# EAGLE design powersupply (EAGLE 9.5.2)
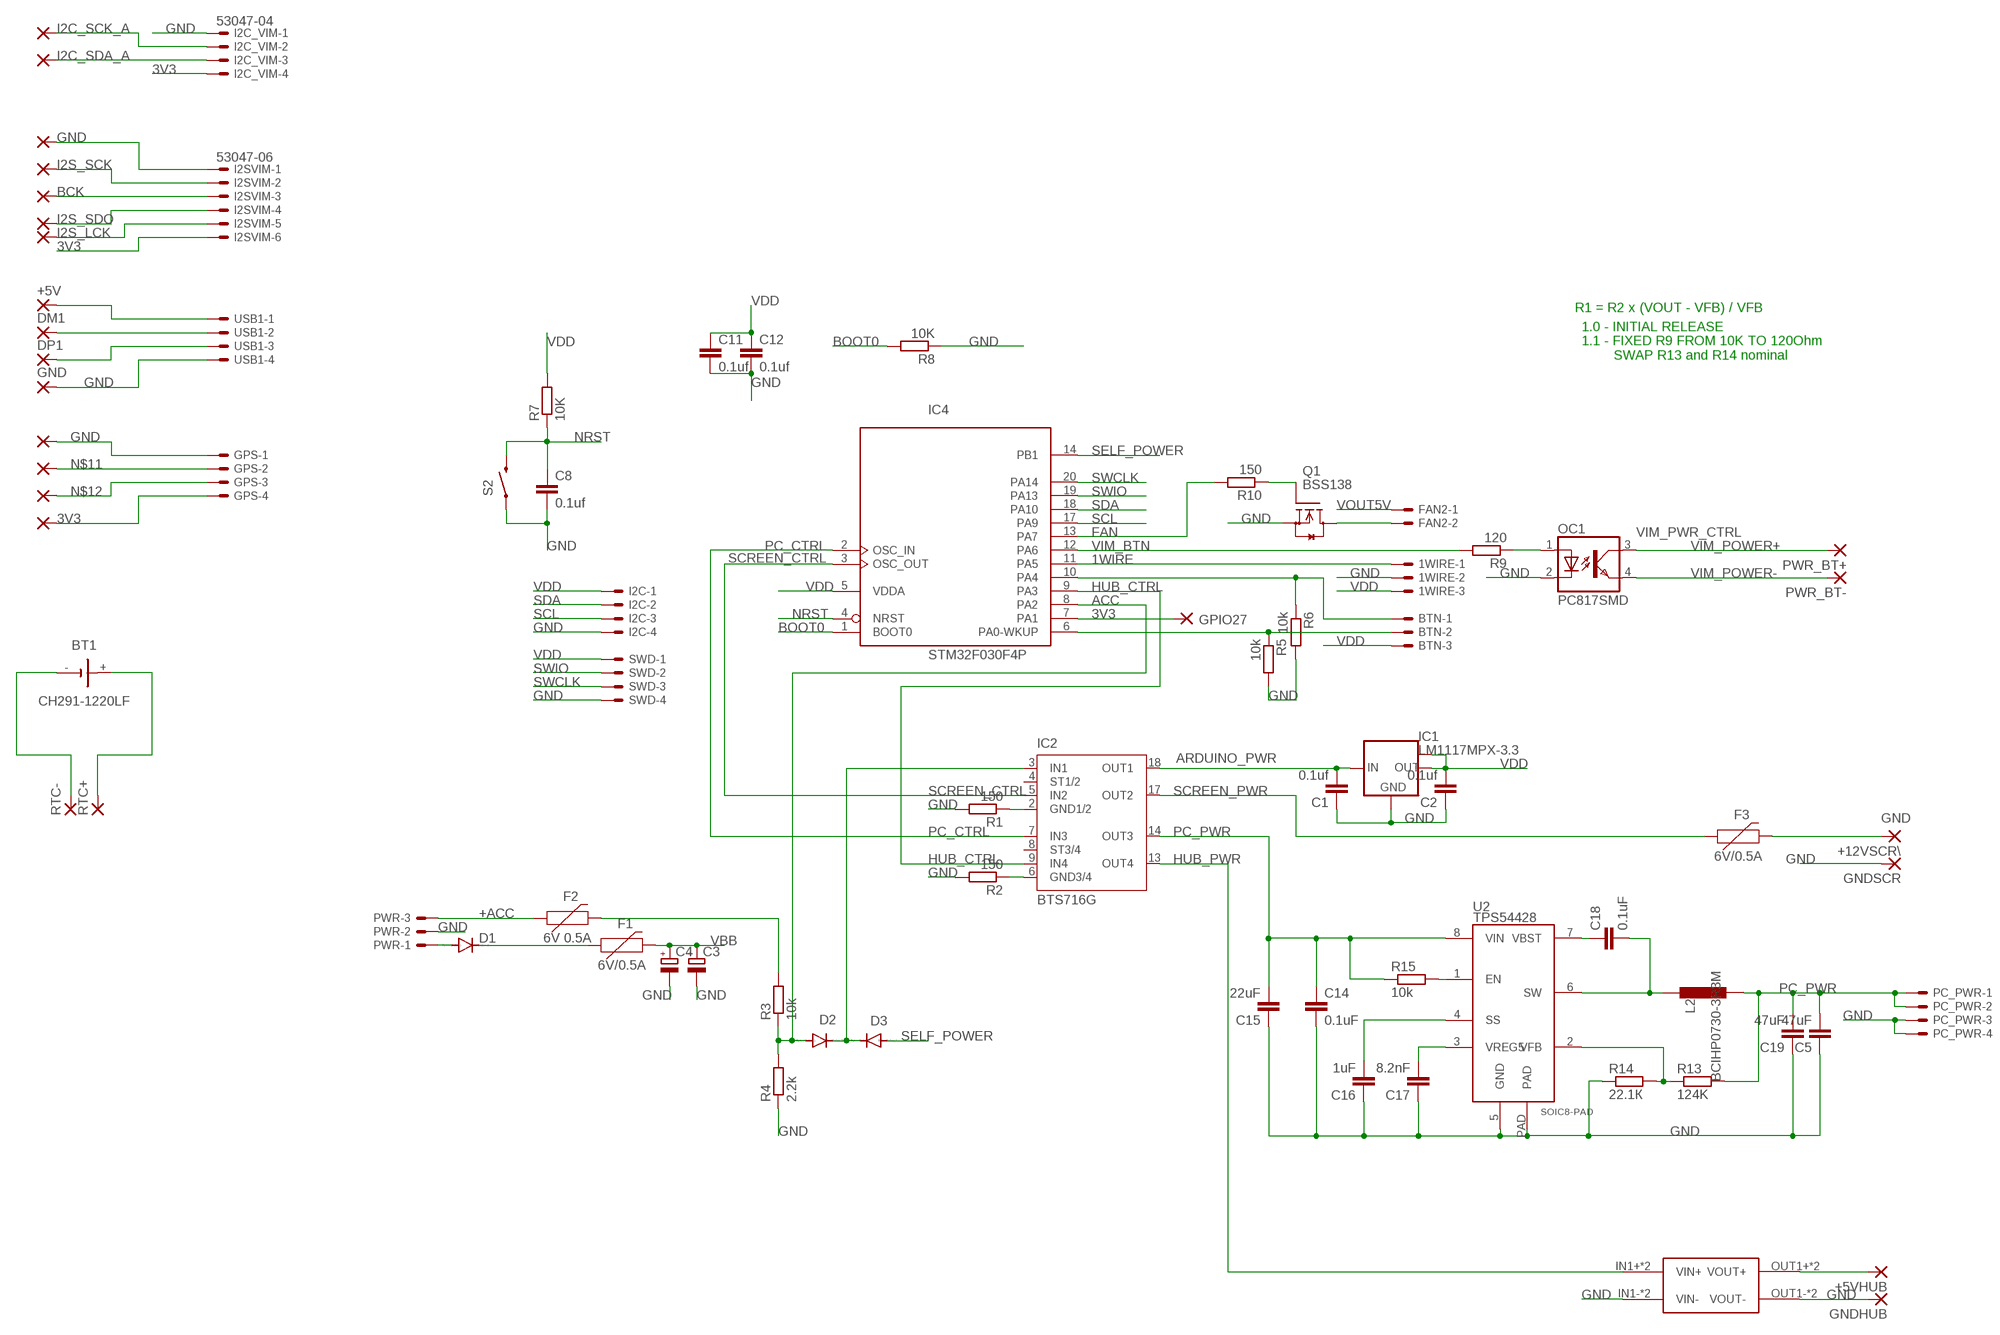
[diagram p0: schematic, sheet 1]

## Parts
1WIRE  53047-03  [53047-03]
3V3_1  1,6/0,8  [1,6/0,8]
22  1,6/0,8  [1,6/0,8]
23  1,6/0,8  [1,6/0,8]
28  1,6/0,8  [1,6/0,8]
29  1,6/0,8  [1,6/0,8]
30  1,6/0,8  [1,6/0,8]
31  1,6/0,8  [1,6/0,8]
32  1,6/0,8  [1,6/0,8]
+5V  1,6/0,8  [1,6/0,8]
+5VHUB  1,6/0,8  [1,6/0,8]
+12VSCR\  1,6/0,8  [1,6/0,8]
BT1  CH291-1220LF  [CH291-1220LF]
BTN  53047-03  [53047-03]
C1  0.1uf  C-EUC0805  [C0805]
C2  0.1uf  C-EUC0805  [C0805]
C3  CPOL-EUUD-8X10  [UD-8X10_NICHICON]
C4  CPOL-EUUD-8X10  [UD-8X10_NICHICON]
C5  47uF  C-EUC1206  [C1206]
C8  0.1uf  C-EUC0805  [C0805]
C11  0.1uf  C-EUC0805  [C0805]
C12  0.1uf  C-EUC0805  [C0805]
C14  0.1uF  C-EUC0805K  [C0805K]
C15  22uF  C-EUC0805  [C0805]
C16  1uF  C-EUC0805K  [C0805K]
C17  8.2nF  C-EUC0805K  [C0805K]
C18  0.1uF  C-EUC0805K  [C0805K]
C19  47uF  C-EUC1206  [C1206]
D1  DIODE-SMB  [SMB]
D2  DIODE-SOD323-W  [SOD323-W]
D3  DIODE-SOD323-W  [SOD323-W]
DM1  1,6/0,8  [1,6/0,8]
DP1  1,6/0,8  [1,6/0,8]
F1  6V/0.5A  PPTC_HALF-AMP  [1206]
F2  6V 0.5A  PPTC_6V500MA  [0805]
F3  6V/0.5A  PPTC_HALF-AMP  [1206]
FAN2  53047-02  [53047-02]
GND  1,6/0,8  [1,6/0,8]
GNDGPS  1,6/0,8  [1,6/0,8]
GNDHUB  1,6/0,8  [1,6/0,8]
GNDSCR  1,6/0,8  [1,6/0,8]
GPIO27  1,6/0,8  [1,6/0,8]
GPS  53047-04  [53047-04]
I2C  i2c  53047-04  [53047-04]
I2C_VIM  53047-04  [53047-04]
I2SVIM  53047-06  [53047-06]
IC1  LM1117MPX-3.3  [SOT223]
IC2  BTS716G  [PG-DSO-20]
IC4  STM32F030F4P  [TSSOP20-I]
L2  BCIHP0730-3R3M  VLS5045EX  [VLS4045EX]
OC1  PC817SMD  [DIL04SMD]
PC_PWR  i2c  53047-04  [53047-04]
PWR  JST-XH-03-PIN-ROUND-PAD  [JST-XH-03-PACKAGE-ROUND-PAD]
PWR_BT+  1,6/0,8  [1,6/0,8]
PWR_BT-  1,6/0,8  [1,6/0,8]
Q1  BSS138  [SOT23]
R1  150  R-EU_R0805  [R0805]
R2  150  R-EU_R0805  [R0805]
R3  10k  R-EU_R0805  [R0805]
R4  2.2k  R-EU_R0805  [R0805]
R5  10k  R-EU_R0805  [R0805]
R6  10k  R-EU_R0805  [R0805]
R7  10K  R-EU_M0805  [M0805]
R8  10K  R-EU_M0805  [M0805]
R9  120  R-EU_M0805  [M0805]
R10  150  R-EU_R0805  [R0805]
R13  124K  R-EU_M0805  [M0805]
R14  22.1К  R-EU_M0805  [M0805]
R15  10k  R-EU_M0805  [M0805]
RTC+  1,6/0,8  [1,6/0,8]
RTC-  1,6/0,8  [1,6/0,8]
RX  1,6/0,8  [1,6/0,8]
S2  SWITCH-MOMENTARY-2-SMD-1101NE  [TACTILE-SWITCH-1101NE]
SWD  53047-04  [53047-04]
TX  1,6/0,8  [1,6/0,8]
U2  TPS54428  [PDSO-8]
U$1  MP1584  [DC-BRICK]
USB1  53047-04  [53047-04]

## Nets
1WIRE: 1WIRE.1 IC4.11(PA5)
3V3: 3V3_1.1(P) GPIO27.1(P) GPS.4 I2C_VIM.4 I2SVIM.6 IC4.7(PA1)
+ACC: F2.2 R3.2
ACC: D2.A IC4.8(PA2) R3.1 R4.2
ARDUINO_PWR: C1.2 IC1.3(IN) IC2.18(OUT1)
BCK: 30.1(P) I2SVIM.3
BOOT0: IC4.1(BOOT0) R8.2
FAN: IC4.13(PA7) R10.2
GND: 1WIRE.2 28.1(P) C1.1 C2.1 C3.- C4.- C5.1 C8.2 C11.2 C12.2 C14.2 C15.1 C16.1 C17.1 C19.1 GND.1(P) GNDGPS.1(P) GNDHUB.1(P) GNDSCR.1(P) GPS.1 I2C.4 I2C_VIM.1 I2SVIM.1 IC1.1(GND) OC1.2(C) PC_PWR.3 PC_PWR.4 PWR.2 Q1.2(S) R1.2 R2.2 R4.1 R5.2 R6.2 R8.1 R14.1 S2.P$1 SWD.4 U2.5(GND) U2.PAD U$1.IN1-(VIN-) U$1.IN2-(VIN-) U$1.OUT1-(VOUT-) U$1.OUT2-(VOUT-) USB1.4
HUB_CTRL: IC2.9(IN4) IC4.9(PA3)
HUB_PWR: IC2.13(OUT4) U$1.IN1+(VIN+) U$1.IN2+(VIN+)
I2C_SCK_A: 22.1(P) I2C_VIM.2
I2C_SDA_A: 23.1(P) I2C_VIM.3
I2S_LCK: 32.1(P) I2SVIM.5
I2S_SCK: 29.1(P) I2SVIM.2
I2S_SDO: 31.1(P) I2SVIM.4
N$1: IC2.2(GND1/2) R1.1
N$2: +5V.1(P) USB1.1
N$3: FAN2.2 Q1.3(D)
N$4: D2.C D3.C IC2.3(IN1)
N$5: IC2.6(GND3/4) R2.1
N$6: BTN.1 IC4.10(PA4) R6.1
N$7: DM1.1(P) USB1.2
N$8: DP1.1(P) USB1.3
N$9: Q1.1(G) R10.1
N$10: BT1.- RTC-.1(P)
N$11: GPS.2 RX.1(P)
N$12: GPS.3 TX.1(P)
N$13: BTN.2 IC4.6(PA0-WKUP) R5.1
N$14: F2.1 PWR.3
N$15: BT1.+ RTC+.1(P)
N$16: D1.A PWR.1
N$18: +5VHUB.1(P) U$1.OUT1+(VOUT+) U$1.OUT2+(VOUT+)
N$19: D1.C F1.1
N$23: +12VSCR\.1(P) F3.2
N$51: C16.2 U2.4(SS)
N$52: C17.2 U2.3(VREG5)
N$53: C18.1 U2.7(VBST)
N$54: C18.2 L2.1 U2.6(SW)
N$55: R13.1 R14.2 U2.2(VFB)
N$56: R15.2 U2.1(EN)
NRST: C8.1 IC4.4(NRST) R7.1 S2.P$2
PC_CTRL: IC2.7(IN3) IC4.2(OSC_IN)
PC_PWR: C14.1 C15.2 IC2.14(OUT3) R15.1 U2.8(VIN)
SCL: I2C.3 IC4.17(PA9)
SCREEN_CTRL: IC2.5(IN2) IC4.3(OSC_OUT)
SCREEN_PWR: F3.1 IC2.17(OUT2)
SDA: I2C.2 IC4.18(PA10)
SELF_POWER: D3.A IC4.14(PB1)
SWCLK: IC4.20(PA14) SWD.3
SWIO: IC4.19(PA13) SWD.2
VBB: C3.+ C4.+ F1.2
VDD: 1WIRE.3 BTN.3 C2.2 C11.1 C12.1 I2C.1 IC1.2(OUT) IC1.TAB(OUT1) IC4.5(VDDA) R7.2 SWD.1
VIM_BTN: IC4.12(PA6) R9.2
VIM_POWER+: OC1.3(COL) PWR_BT+.1(P)
VIM_POWER-: OC1.4(EMIT) PWR_BT-.1(P)
VIM_PWR_CTRL: OC1.1(A) R9.1
VOUT5V: C5.2 C19.2 FAN2.1 L2.2 PC_PWR.1 PC_PWR.2 R13.2
Unconnected: IC2.4(ST1/2) IC2.8(ST3/4)

## Notes on the sheet
- R1 = R2 x (VOUT - VFB) / VFB
- 1.0 - INITIAL RELEASE
  1.1 - FIXED R9 FROM 10K TO 120Ohm
          SWAP R13 and R14 nominal

## Power pins joined to a net without a drawn wire
GND: IC4.15(GND)
VBB: IC2.1(VBB) IC2.10(VBB) IC2.11(VBB) IC2.12(VBB) IC2.15(VBB) IC2.16(VBB) IC2.19(VBB) IC2.20(VBB)
VDD: IC4.16(VDD)

## Library data of the parts
1WIRE BTN = con-molex:53?-03: CONNECTOR wire to board 1.25 mm (.049 inch) pitch header; MF: MOLEX; MPN: 530470310; OC_FARNELL: 9732853; OC_NEWARK: 14R5412
3V3_1 22 23 28-32 +5V +5VHUB +12VSCR\ DM1 DP1 GND GNDGPS GNDHUB GNDSCR GPIO27 PWR_BT+ PWR_BT- RTC+ RTC- RX TX = wirepad:1,6/0,8: THROUGH-HOLE PAD
BT1 = battery:CH291-1220LF: Battery Holder, SMT, 12mm multicomp PART NO. CH291-1220LF Source: Data sheet <http://www.farnell.com/datasheets/1505860.pdf>
C1 C2 C8 C11 C12 C14 C18 = rcl:C-EU: CAPACITOR, European symbol; MPN: CL21B104KBFNNNE; SPICEPREFIX: C
C3 C4 = rcl:CPOL-EU: POLARIZED CAPACITOR, European symbol; SPICEPREFIX: C
C5 C19 = rcl:C-EU: CAPACITOR, European symbol; MPN: CL31A476MPHNNNE; SPICEPREFIX: C
C15 = rcl:C-EU: CAPACITOR, European symbol; MPN: CL31A226KAHNNNE; SPICEPREFIX: C; URL: https://lcsc.com/product-detail/Multilayer-Ceramic-Capacitors-MLCC-SMD-SMT_SAMSUNG_CL31A226KAHNNNE_22uF-226-10-25V_C12891.html
C16 = rcl:C-EU: CAPACITOR, European symbol; MPN: CL21B105KAFNNNE; SPICEPREFIX: C; URL: https://lcsc.com/product-detail/Multilayer-Ceramic-Capacitors-MLCC-SMD-SMT_Samsung-Electro-Mechanics_CL21B105KAFNNNE_Samsung-Electro-Mechanics-CL21B105KAFNNNE_C116352.html
C17 = rcl:C-EU: CAPACITOR, European symbol; MPN: CL21B822KBANNNC; SPICEPREFIX: C; URL: https://lcsc.com/product-detail/Multilayer-Ceramic-Capacitors-MLCC-SMD-SMT_SAMSUNG_CL21B822KBANNNC_8-2nF-822-10-50V_C170117.html
D1-D3 = diode:DIODE-: DIODE
F1 F3 = SparkFun-Fuses:PPTC: Resettable Fuse PPTC Resettable Fuse. Really a sort of resistor with a polymeric positive temperature coefficient whose resistance increases dramatically with an increase in temperature. When heated by the power passing through the resistance rises causing the current to be limited, protecting the circuit. This is achieved by the transition of the polymer from a crystalline to an amorphous state where the conductive carbon separates breaking the conductive pathways found in the cool crystalline structure. When a PPTC cools back down it resumes conducting letting the circuit turn back on. SparkFun Products: SparkFun RedBoard - Programmed with Arduino <https://www.sparkfun.com/products/12757> Pro Micro - 5V/16MHz <https://www.sparkfun.com/products/12640> Arduino Pro 328 - 5V/16MHz <https://www.sparkfun.com/products/10915> MP3 Trigger <https://www.sparkfun.com/products/13720>; PROD_ID: RES-08585
F2 = SparkFun-Fuses:PPTC: Resettable Fuse PPTC Resettable Fuse. Really a sort of resistor with a polymeric positive temperature coefficient whose resistance increases dramatically with an increase in temperature. When heated by the power passing through the resistance rises causing the current to be limited, protecting the circuit. This is achieved by the transition of the polymer from a crystalline to an amorphous state where the conductive carbon separates breaking the conductive pathways found in the cool crystalline structure. When a PPTC cools back down it resumes conducting letting the circuit turn back on. SparkFun Products: SparkFun RedBoard - Programmed with Arduino <https://www.sparkfun.com/products/12757> Pro Micro - 5V/16MHz <https://www.sparkfun.com/products/12640> Arduino Pro 328 - 5V/16MHz <https://www.sparkfun.com/products/10915> MP3 Trigger <https://www.sparkfun.com/products/13720>; PROD_ID: 13945
FAN2 = con-molex:53?-02: CONNECTOR wire to board 1.25 mm (.049 inch) pitch header; MF: MOLEX; MPN: 53047-0210; OC_FARNELL: 9733051; OC_NEWARK: 57H4701
GPS I2C I2C_VIM PC_PWR SWD USB1 = con-molex:53?-04: CONNECTOR wire to board 1.25 mm (.049 inch) pitch header; MF: WALDOM/MOLEX; MPN: 53047-0410; OC_FARNELL: 9733060; OC_NEWARK: 38C9900
I2SVIM = con-molex:53?-06: CONNECTOR wire to board 1.25 mm (.049 inch) pitch header
IC1 = lm1117:LM1117MPX-*; MPN: LM1117IMPX-3.3/NOPB
IC2 = infineon:BTS716G: Smart High-Side Power Switch Four Channels: 4 x 140mOhm staus Feedback Source: http://www.infineon.com/dgdl/BTS716G.pdf; OC_FARNELL: unknown; OC_NEWARK: unknown
IC4 = micro-stm_v3:STM32F030F*P: ARM 32-bit Cortex™-M0 CPU 48 MHz maximum frequency 16 Kbytes of Flash memory 4 kbytes of SRAM 15 GPIOs 2.4 to 3.6 V application supply
L2 = bt_inductor:VLS5045EX: TDK VLS-EX Series, VLS5045EX Type Shielded Wirewound Inductor for power circuits. High magnetic shield construction achieved by a ferrite magnetic material and compatible with high-density mounting. Larger current and lower Rdc have been achieved by optimizing the ferrite core figure. Datasheet.pdf <https://product.tdk.com/info/en/catalog/datasheets/inductor_commercial_power_vls5045ex_en.pdf>; MN: TDK; MPN: VLS5045EX-3R3N; URL: https://lcsc.com/product-detail/Power-Inductors_TDK_VLS5045EX-3R3N_TDK-VLS5045EX-3R3N_C307875.html
OC1 = my_mixed:PC817*: SHARP OPTO COUPLER; MPN: PC817X2CSP9F
PWR = Rembrandt Electronics - JST XH Connectors v1-0:JST-XH-03-PIN: JST XH Connector 2 Pin Wire to board connector. Pitch: 2,54 mm, (0.100") Number of pins: 3 Created by Rembrandt Electronics www.rembrandtelectronics.com
Q1 = m-pad-2.1:BSS138: Fairchild Semiconductors BSS138 N-Channel Logic Level Enhancement Mode Field Effect Transistor General Description: These N-Channel enhancement mode field effect transistors are produced using Fairchild's proprietary, high cell density, DMOS technology. These products have been designed to minimize on-state resistance while provide rugged, reliable, and fast switching performance.These products are particularly suited for low voltage, low current applications such as small servo motor control, power MOSFET gate drivers, and other switching applications. Features: 0.22 A, 50 V. RDS(ON) = 3.5Ohm @ VGS = 10 V RDS(ON) = 6.0Ohm @ VGS = 4.5 V High density cell design for extremely low RDS(ON) Rugged and Reliable Compact industry standard SOT-23 surface mount package Please send any comments to: messi@users.sourceforge.net
R1-R6 R10 = resistor:R-EU_: RESISTOR, European symbol
R7-R9 R15 = rcl:R-EU_: RESISTOR, European symbol; SPICEPREFIX: R
R13 = rcl:R-EU_: RESISTOR, European symbol; MPN: TR0805B22K1P0525Z; SPICEPREFIX: R
R14 = rcl:R-EU_: RESISTOR, European symbol; MPN: AR05BTCW1253; SPICEPREFIX: R
S2 = dc-dc:SWITCH-MOMENTARY-2: Various NO switches- pushbuttons, reed, etc
U2 = borkedlabs-powerics:TPS54428; MANU: TI; MPN: TPS54428DDAR; PACKAGE: SOIC8-PAD; URL: https://lcsc.com/product-detail/DC-DC-Converters_Texas-Instruments_TPS54428DDAR_Texas-Instruments-Texas-Instruments-TPS54428DDAR_C138717.html
U$1 = MP1584-dc-brick:MP1584: MP1584-dc-brick-pcb Step down Input: 4.5V - 28V Ouput 0.8V - 25V max. 3A Cheap on ebay

## Board
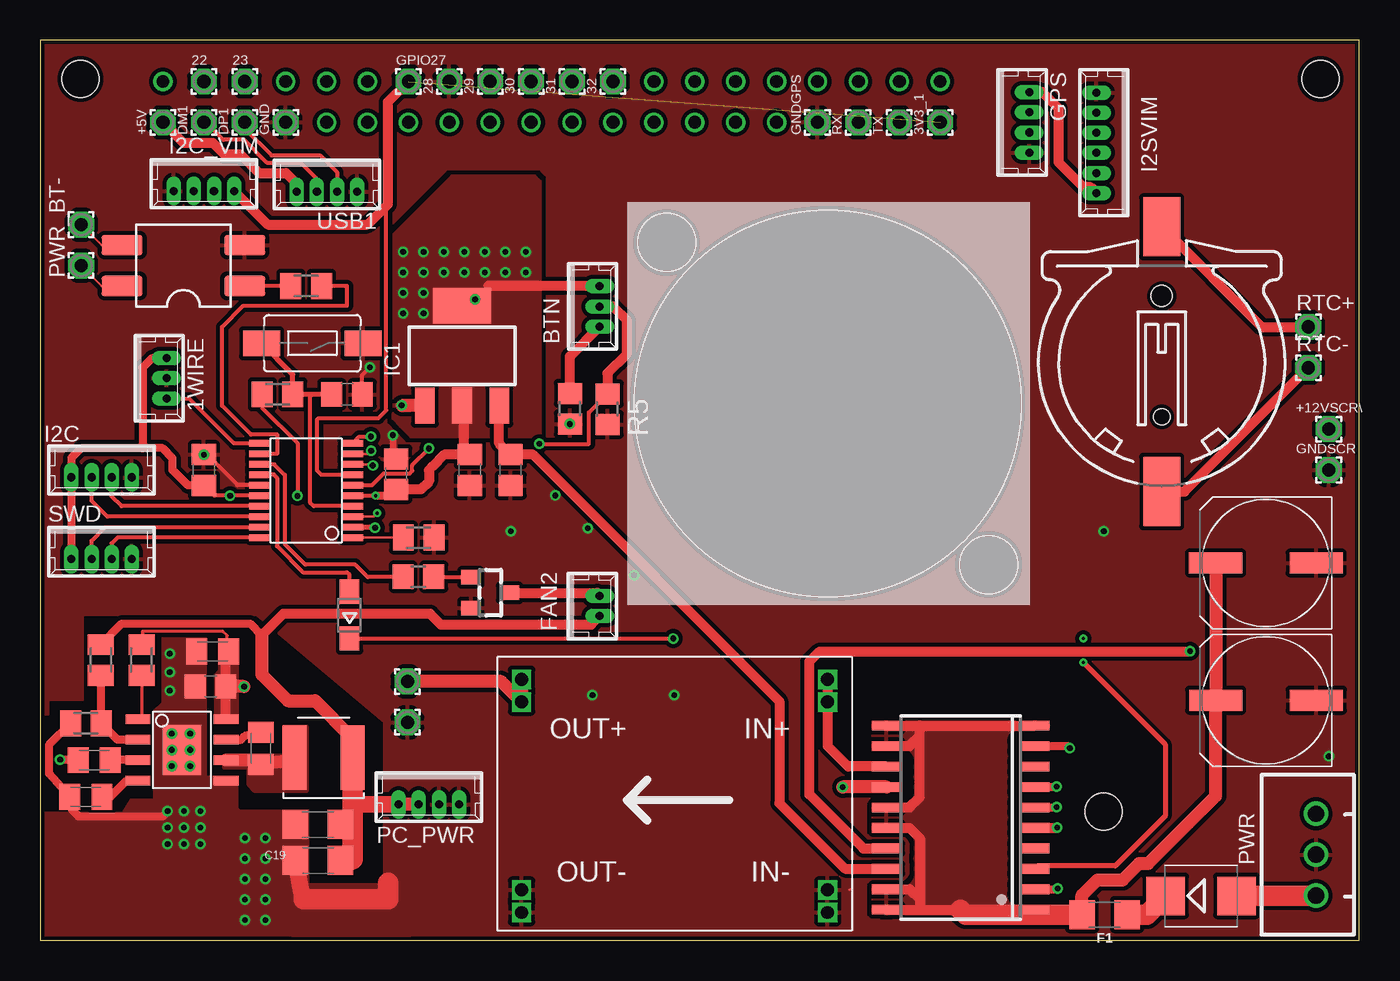
[diagram p1: board, top side]
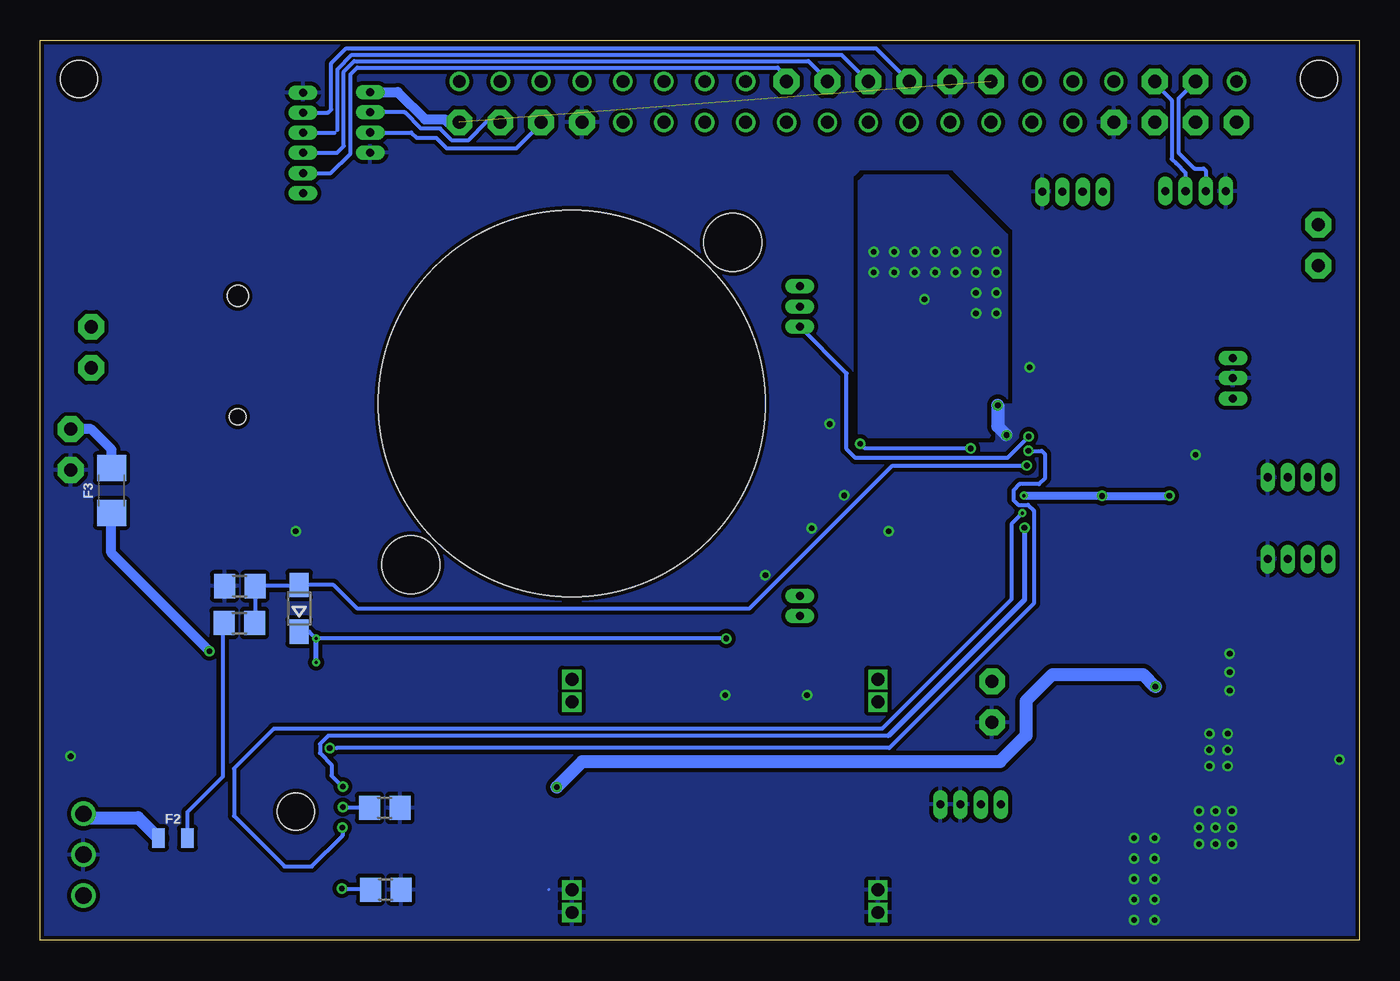
[diagram p2: board, bottom side, seen from below]

Size 81.9 x 55.9 mm. Coordinates in mm from the lower left corner, seen from the top.
Outline: 0,0 81.9,0 81.9,55.9 0,55.9 0,0
Copper layers (1*16): Top 0.035mm / dielectric 1.5mm / Bottom 0.035mm
Design rules "jlcpcb": minimum track width 5mil, minimum drill 0.2mm, track to track 5mil, track to pad 5mil, pad to pad 5mil, via to via 5mil, smd to smd 5mil, copper to edge 0.2mm, drill to drill 6mil, minimum pad ring 0.2mm, minimum via ring 0.15mm, stop-mask expansion 4mil, vias tented up to drill 0mil, thermal gap 10mil
Holes 2.3 mm at 2.5,53.5 79.5,53.5 66.03,8
Holes 24 mm at 48.89,33.34
Holes 3.6 mm at 38.89,43.34 58.89,23.34

### Footprints (pad centres in the part's own frame; a part is rotated, then mirrored left to right if it is on the bottom)
53047-03 = drill 0.5 pad 0.698 long: 1 1.25,0.45; 2 0,0.45; 3 -1.25,0.45
1,6/0,8 = drill 0.813 pad 1.6 octagon: 1 0,0
CH291-1220LF = smd 2.3 x 3.66: + 0,-2.296 | smd 2.3 x 4.3: - 0,14.146 | hole 1.3: 0,2 | hole 1: 0,9.5
C0805 = smd 1.3 x 1.5: 1 -0.95,0; 2 0.95,0
UD-8X10_NICHICON = smd 3.3 x 1.3: + 3.125,0; - -3.125,0
C1206 = smd 1.6 x 1.8: 1 -1.4,0; 2 1.4,0
C0805K = smd 1.3 x 1.6: 1 -1,0; 2 1,0
SMB = smd 2.4 x 2.4: A 2.2,0; C -2.2,0
SOD323-W = smd 1.5 x 1.2: A 1.45,0; C -1.45,0
1206 = smd 1.6 x 1.8: 1 -1.4,0; 2 1.4,0
0805 = smd 0.8 x 1.2: 1 -0.9,0; 2 0.9,0
53047-02 = drill 0.5 pad 0.698 long: 1 0.625,0.45; 2 -0.625,0.45
53047-04 = drill 0.5 pad 0.698 long: 1 1.875,0.45; 2 0.625,0.45; 3 -0.625,0.45; 4 -1.875,0.45
53047-06 = drill 0.5 pad 0.698 long: 1 3.125,0.45; 2 1.875,0.45; 3 0.625,0.45; 4 -0.625,0.45; 5 -1.875,0.45; 6 -3.125,0.45
SOT223 = smd 1.219 x 2.235: 1 -2.311,-3.099; 2 0,-3.099; 3 2.311,-3.099 | smd 3.6 x 2.2: TAB 0,3.099
PG-DSO-20 = smd 0.6 x 1.8: 1 -5.715,-4.6; 2 -4.445,-4.6; 3 -3.175,-4.6; 4 -1.905,-4.6; 5 -0.635,-4.6; 6 0.635,-4.6; 7 1.905,-4.6; 8 3.175,-4.6; 9 4.445,-4.6; 10 5.715,-4.6; 11 5.715,4.6; 12 4.445,4.6; 13 3.175,4.6; 14 1.905,4.6; 15 0.635,4.6; 16 -0.635,4.6; 17 -1.905,4.6; 18 -3.175,4.6; 19 -4.445,4.6; 20 -5.715,4.6
TSSOP20-I = smd 0.4 x 1.35: 1 -2.925,-2.875; 2 -2.275,-2.875; 3 -1.625,-2.875; 4 -0.975,-2.875; 5 -0.325,-2.875; 6 0.325,-2.875; 7 0.975,-2.875; 8 1.625,-2.875; 9 2.275,-2.875; 10 2.925,-2.875; 11 2.925,2.875; 12 2.275,2.875; 13 1.625,2.875; 14 0.975,2.875; 15 0.325,2.875; 16 -0.325,2.875; 17 -0.975,2.875; 18 -1.625,2.875; 19 -2.275,2.875; 20 -2.925,2.875
VLS4045EX = smd 1.5 x 4: 1 -1.8,0; 2 1.8,0
DIL04SMD = smd 1.27 x 2.54: 1 -1.27,-3.81; 2 1.27,-3.81; 3 1.27,3.81; 4 -1.27,3.81
JST-XH-03-PACKAGE-ROUND-PAD = drill 1.016: 1 -2.54,0; 2 0,0; 3 2.54,0
SOT23 = smd 0.9 x 1.2: 1 -0.95,-1.2; 2 0.95,-1.2; 3 0,1.2
R0805 = smd 1.3 x 1.5: 1 -0.95,0; 2 0.95,0
M0805 = smd 1.3 x 1.6: 1 -0.95,0; 2 0.95,0
TACTILE-SWITCH-1101NE = smd 2.3 x 1.6: P$1 -3.15,0; P$2 3.15,0
PDSO-8 = smd 1.524 x 0.61: 1 -2.743,1.905; 2 -2.743,0.635; 3 -2.743,-0.635; 4 -2.743,-1.905; 5 2.743,-1.905; 6 2.743,-0.635; 7 2.743,0.635; 8 2.743,1.905 | smd 2.4 x 3.1: PAD 0,0
DC-BRICK = drill 0.8 square: IN1+ 1.5,1.4; IN1- 1.5,14.47; IN2+ 1.5,2.8; IN2- 1.5,15.87; OUT1+ 20.5,1.4; OUT1- 20.5,14.47; OUT2+ 20.5,2.8; OUT2- 20.5,15.87

### Placement (x,y rotation side)
1WIRE  7.39,34.91 270 top
3V3_1  55.88,50.8 90 top
22  10.16,53.34 0 top
23  12.7,53.34 0 top
28  25.4,53.34 90 top
29  27.94,53.34 90 top
30  30.48,53.34 90 top
31  33.02,53.34 90 top
32  35.56,53.34 90 top
+5V  7.62,50.8 90 top
+5VHUB  22.8,16.08 0 top
+12VSCR\  80.01,31.75 0 top
BT1  69.64,42.02 180 top
BTN  34.29,39.37 270 top
C1  29.21,29.21 90 top
C2  26.67,29.21 90 top
C3  76.1,23.44 180 top
C4  76.11,14.91 180 top
C5  17.24,7.2 0 top
C8  19.05,33.91 0 top
C11  10.16,29.21 90 top
C12  22.1,28.96 90 top
C14  10.71,17.94 180 top
C15  10.58,15.77 0 top
C16  2.83,8.91 0 top
C17  3.35,11.2 0 top
C18  13.7,11.93 270 top
C19  17.24,4.96 0 top
D1  72.08,2.76 0 top
D2  65.82,20.62 90 bottom
D3  19.2,20.2 90 top
DM1  10.16,50.8 90 top
DP1  12.7,50.8 90 top
F1  66.09,1.59 180 top
F2  73.66,6.35 0 bottom
F3  77.47,27.94 90 bottom
FAN2  34.28,20.76 270 top
GND  15.24,50.8 90 top
GNDGPS  48.26,50.8 90 top
GNDHUB  22.8,13.54 0 top
GNDSCR  80.01,29.21 0 top
GPIO27  22.86,53.34 0 top
GPS  60.96,50.8 270 top
I2C  3.81,29.21 180 top
I2C_VIM  10.16,46.99 180 top
I2SVIM  66.04,49.53 90 top
IC1  26.19,36.3 0 top
IC2  57.15,7.62 90 top
IC4  16.51,27.94 90 top
L2  17.6,11.35 0 top
OC1  8.89,41.91 90 top
PC_PWR  24.13,8.89 180 top
PWR  79.22,5.32 90 top
PWR_BT+  2.54,44.45 0 top
PWR_BT-  2.54,41.91 0 top
Q1  27.94,21.59 270 top
R1  60.45,3.15 0 bottom
R2  60.51,8.23 0 bottom
R3  69.54,19.71 180 bottom
R4  69.51,22 0 bottom
R5  35.22,32.99 270 top
R6  32.89,33.02 270 top
R7  14.73,33.91 180 top
R8  23.5,25.02 180 top
R9  16.51,40.64 0 top
R10  23.48,22.58 180 top
R13  3.76,17.41 90 top
R14  2.83,13.48 0 top
R15  6.3,17.41 270 top
RTC+  78.74,38.1 0 top
RTC-  78.74,35.56 0 top
RX  50.8,50.8 90 top
S2  16.89,37.08 180 top
SWD  3.81,24.13 180 top
TX  53.34,50.8 90 top
U2  8.8,11.83 0 top
U$1  50.39,17.6 180 top
USB1  17.8,46.94 180 top

### Tracks (layer width: path | path; a pad name or v marks a point on that pad's centre or on a via)
1WIRE
  Top 0.254: IC4.11 12.04,30.86 9.38,33.52 9.24,33.66 1WIRE.1
3V3  (1 unrouted)
  Top 0.254: IC4.7 17.46,28.91 17.19,29.19 17.19,32.34 17.28,32.43 21,32.43 21.48,32.91 21.48,45.61 21.59,45.72 | 13.88,44.7 14.12,44.45
  Top 0.61: I2SVIM.6 65.22,46.77 64.78,46.77 63.24,48.31 63.24,51.66 62.23,52.67 GPS.4 | I2C_VIM.4 14.12,44.45 20.32,44.45 21.59,45.72 21.59,52.07 GPIO27.1
  Bottom 0.152: 58.17,50.82 56.04,50.82 56.02,50.8 3V3_1.1
  Bottom 0.61: GPS.4 59.7,52.67 58.02,50.99 56.77,50.99 56.58,50.8 3V3_1.1
+ACC
  Bottom 0.254: R3.2 70.58,19.62 70.58,10.15 72.76,7.97 F2.2
ACC  (via drill 0.35)
  Top 0.152: IC4.8 20.57,29.57 v20.64,29.49
  Bottom 0.254: v20.64,29.49 28.98,29.49 37.85,20.62 62.23,20.62 63.68,22.07 D2.A 65.89,22 R4.2 68.56,19.74 R3.1
ARDUINO_PWR
  Top 0.152: 28.5,33.02 IC1.3
  Top 0.61: IC2.18 49.98,4.45 45.9,8.52 45.9,14.85 30.59,30.16 C1.2 28.5,30.87 28.5,33.02
BCK
  Bottom 0.152: 63.63,50.16 63.45,50.34
  Bottom 0.254: I2SVIM.3 63.63,50.16 | 63.45,50.34 63.45,54.1 62.55,55 32.14,55 30.1
BOOT0
  Top 0.152: IC4.1 R8.2
  Top 0.305: IC4.1
FAN
  Top 0.254: IC4.13 14.54,29.57 15.19,28.91 15.19,24.61 16.45,23.34 19.54,23.34 20.34,22.54 20.38,22.58 R10.2
GND  (via drill 0.35)
  Top 0.152: 50.26,3.13 50.31,3.18 | 22.48,33.2 v22.44,33.24
  Top 0.254: IC4.15 12.25,28.27 10.35,30.16 C11.2 | C8.2 20,35.12 v20.46,35.58
  Top 0.305: 2.39,7.7 2.45,7.7
  Top 0.406: v21.9,31.38 21.9,30.1 C12.2
  Top 0.508: C17.1 2.32,11.22 v1.24,11.22 | R14.1 0.53,12.13 0.53,10.37 C16.1 1.96,8.13 2.39,7.7 | 2.45,7.7 7.59,7.7 v7.91,8.02
  Top 0.813: IC1.1 22.48,33.2
  Top 1.016: 16.35,2.54 16.28,2.61 C19.1
  Top 1.27: 16.35,2.54 21.59,2.54 21.59,3.57
  Bottom 0.152: 50.31,3.18 50.34,3.15 | 59.5,8.17 R2.2 | 21.93,31.41 v21.9,31.38
  Bottom 0.813: v22.44,33.24 22.44,31.92 21.93,31.41
  other vias: 10.16,30.16 32.89,32.07 8.16,12.85 9.31,12.85 9.31,11.83 8.16,11.83 8.16,10.81 9.31,10.81 8.93,8.02 9.94,8.02 9.94,7 8.93,7 7.91,7 7.91,5.99 8.93,5.99 9.94,5.99 8.04,15.51 8.04,16.66 8.04,17.8 13.97,1.27 13.97,6.35 13.97,5.08 13.97,3.81 13.97,2.54 12.7,6.35 12.7,5.08 12.7,3.81 12.7,2.54 12.7,1.27 29.21,25.4 33.99,25.59 31.98,27.63 36.87,22.68 39.37,15.24 34.29,15.24 80.01,11.43 66.04,25.4
  pour Top (isolate 0.254, rank 6): -1.27,57.15 -1.27,14.04 0.51,14.04 0.51,14.94 2.64,14.94 2.64,20.22 13.44,20.22 21.36,13.58 21.36,0 82.55,0 82.55,57.15
  pour Bottom (isolate 0.254, rank 6): -0.86,58.42 83.82,58.42 83.82,0 -0.86,0
  pour Top (isolate 0.254, no thermals): 7.53,20.97 7.53,14.75 7.02,14.24 7.02,8.76 5.6,8.76 5.08,7.95 -0.39,7.95 -0.39,-0.83 16.7,-0.83 16.7,8.09 12.41,8.09 12.3,8.21 12.3,10.18 10.32,10.18 10.32,20.97
  pour Top: 15.72,3.45 22.86,3.45 22.86,-1.27 15.72,-1.27
HUB_CTRL  (via drill 0.35)
  Top 0.152: IC4.9 20.36,30.21 v20.54,30.4
  Top 0.508: IC2.9 63.8,12.06 v63.93,11.94
  Bottom 0.152: 63.5,11.94 v63.93,11.94
  Bottom 0.254: v20.54,30.4 19.72,30.4 19.53,30.21 19.53,28.68 19.88,28.33 21.09,28.33 21.47,27.94 21.47,27.35 21.18,27.05 20.57,27.05 20.21,26.69 20.21,20.92 29.19,11.94 63.5,11.94
HUB_PWR
  Top 0.61: IC2.13 50.16,10.79 48.89,12.07 U$1.IN2+ U$1.IN1+
I2C_SCK_A
  Bottom 0.254: 22.1 11.22,52.28 11.22,48.93 10.23,47.94 9.66,47.94 9.54,47.81 I2C_VIM.2
I2C_SDA_A
  Bottom 0.152: 23.1 12.7,53.23 | 11.37,48.26 11.37,48.21
  Bottom 0.254: 12.7,53.23 11.64,52.17 11.64,48.53 11.37,48.26 10.79,47.67 I2C_VIM.3
I2S_LCK
  Bottom 0.254: I2SVIM.5 63.85,47.66 62.64,48.87 62.64,53.79 62.22,54.21 36.12,54.21 35.56,53.65 32.1
I2S_SCK
  Bottom 0.254: I2SVIM.2 64.03,51.41 63.84,51.6 63.84,54.47 62.91,55.4 30,55.4 29.1
I2S_SDO
  Bottom 0.254: I2SVIM.4 63.48,48.91 63.05,49.33 63.05,53.96 62.41,54.6 34.2,54.6 33.02,53.42 31.1
N$1  (via drill 0.35)
  Top 0.152: 63.15,3.17 v63.18,3.21
  Top 0.508: IC2.2 63.15,3.17
  Bottom 0.152: 61.46,3.21 R1.1
  Bottom 0.254: v63.18,3.21 61.46,3.21
N$2
  Top 0.152: 15.93,46.99 USB1.1
  Top 0.61: +5V.1 8.89,49.53 10.71,49.53 11.42,48.82 12.41,48.82 13.58,47.65 15.27,47.65 15.93,46.99
N$3
  Top 0.61: FAN2.2 34.6,21.59 Q1.3
N$4  (via drill 0.2, 0.35)
  Top 0.254: D3.C v39.3,18.75
  Top 0.305: IC2.3 61.93,4.62 66.75,4.62 69.85,7.72 69.85,12.18 v64.77,17.26
  Bottom 0.254: D2.C 65.19,19.17 v64.77,18.75 v39.3,18.75
  Bottom 0.305: v64.77,17.26 v64.77,18.75
N$5  (via drill 0.35)
  Top 0.508: IC2.6 63.09,8.26 v63.12,8.28
  Bottom 0.152: 63.07,8.23 v63.12,8.28
  Bottom 0.254: R2.1 63.07,8.23
N$6  (via drill 0.35)
  Top 0.254: IC4.10 19.81,31.29 v20.52,31.29
  Top 0.61: R6.1 32.89,36.27 BTN.1
  Bottom 0.254: v20.52,31.29 21.84,29.97 31.29,29.97 31.83,30.51 31.83,35.21 BTN.1
N$7
  Top 0.152: 17.18,47.3 USB1.2
  Top 0.254: DM1.1 10.28,50.8 11.36,49.72 12.65,49.72 14.06,48.31 16.16,48.31 17.18,47.3
N$8
  Top 0.254: DP1.1 12.7,50.42 14.37,48.76 17.36,48.76 18.43,47.7 USB1.3
N$9
  Top 0.254: R10.1 26.7,22.58 Q1.1
N$10
  Top 0.61: BT1.- 71.05,27.87 RTC-.1
N$11
  Bottom 0.254: RX.1 50.8,50.73 52.35,49.18 56.65,49.18 57.32,49.84 58.53,49.84 58.86,50.17 GPS.2
N$12
  Bottom 0.254: TX.1 54.22,50.8 55.34,49.68 56.33,49.68 57.07,50.42 58.26,50.42 59.26,51.42 GPS.3
N$13  (via drill 0.35)
  Top 0.254: v24.13,30.55 23.1,29.52 23.1,29.15 22.95,29 21.34,29 20.6,28.27 IC4.6 | R5.1 34.07,32.79 34.07,30.84 v30.98,30.84
  Top 0.61: BTN.2 35.56,39.37 36.39,38.54 36.39,36.39 35.22,35.22 R5.1
  Bottom 0.254: v24.13,30.55 30.69,30.55 v30.98,30.84
N$14
  Bottom 0.813: PWR.3 78.98,7.62 75.83,7.62 F2.1
N$15
  Top 0.61: BT1.+ 75.86,38.1 RTC+.1
N$16
  Top 1.016: 74.3,2.78 D1.A
  Top 1.27: PWR.1 74.3,2.78
N$17  (via drill 0.8)
  other vias: 7.62,53.34
N$18
  Top 0.813: U$1.OUT1+ U$1.OUT2+ 28.62,16.07 +5VHUB.1
N$19
  Top 1.27: F1.1 68.71,1.59 D1.C
N$20  (via drill 0.8)
  other vias: 15.24,53.34
N$21  (via drill 0.8)
  other vias: 17.78,53.34
N$22  (via drill 0.8)
  other vias: 20.32,53.34
N$23
  Bottom 0.61: F3.2 77.47,30.48 78.74,31.75 +12VSCR\.1
N$27  (via drill 0.8)
  other vias: 17.78,50.8
N$28  (via drill 0.8)
  other vias: 20.32,50.8
N$29  (via drill 0.8)
  other vias: 22.86,50.8
N$30  (via drill 0.8)
  other vias: 25.4,50.8
N$31  (via drill 0.8)
  other vias: 27.94,50.8
N$32  (via drill 0.8)
  other vias: 30.48,50.8
N$33  (via drill 0.8)
  other vias: 33.02,50.8
N$34  (via drill 0.8)
  other vias: 35.56,50.8
N$35  (via drill 0.8)
  other vias: 38.1,50.8
N$36  (via drill 0.8)
  other vias: 40.64,50.8
N$37  (via drill 0.8)
  other vias: 43.18,50.8
N$38  (via drill 0.8)
  other vias: 45.72,50.8
N$40  (via drill 0.8)
  other vias: 38.1,53.34
N$41  (via drill 0.8)
  other vias: 40.64,53.34
N$42  (via drill 0.8)
  other vias: 43.18,53.34
N$43  (via drill 0.8)
  other vias: 45.72,53.34
N$44  (via drill 0.8)
  other vias: 48.26,53.34
N$45  (via drill 0.8)
  other vias: 50.8,53.34
N$46  (via drill 0.8)
  other vias: 53.34,53.34
N$47  (via drill 0.8)
  other vias: 55.88,53.34
N$51
  Top 0.508: U2.4 5.37,9.93 4.36,8.91 C16.2
N$52
  Top 0.508: U2.3 C17.2
N$53
  Top 0.508: C18.1 12.71,12.69 12.48,12.46 U2.7
N$54
  Top 0.813: U2.6 13.57,11.2 C18.2 15.65,11.19 L2.1
  pour Top (no thermals): 11.43,11.43 12.66,11.43 12.72,11.49 15.12,11.49 15.15,11.52 15.15,13.29 16.53,13.29 16.53,9.27 13.32,9.27 12.95,9.64 12.95,10.71 11.43,10.71
N$55
  Top 0.508: U2.2 4.8,12.46 R14.2 3.76,13.51 R13.1
N$56
  Top 0.2: R15.2 6.3,13.97 U2.1
NRST
  Top 0.152: 16.76,33.78 16.89,33.91
  Top 0.254: IC4.4 16.98,26.96 16.76,27.18 16.76,33.78
  Top 0.305: C8.1 16.89,33.91 R7.1 15.68,35.14 S2.P$2
PC_CTRL  (via drill 0.35)
  Top 0.152: 20.75,25.66 v20.79,25.62
  Top 0.305: IC4.2 20.75,25.66
  Top 0.508: IC2.7 63.1,9.53 v63.12,9.54
  Bottom 0.254: v63.12,9.54 63.81,10.23 63.81,10.9 64.53,11.63 64.53,12.19 64.03,12.7 29.24,12.7
  Bottom 0.305: v20.79,25.62 20.79,21.15 29.24,12.7
PC_PWR  (via drill 0.35)
  Top 0.2: C14.1 11.61,18.93 11.34,19.2 6.35,19.2 | 6.3,18.5 R15.1
  Top 0.203: 6.35,19.2 6.35,18.55 6.3,18.5
  Top 0.61: U2.8 11.53,13.75 C15.2 11.53,17.89 C14.1
  Top 0.813: v12.66,15.75 12.64,15.77 C15.2 | IC2.14 49.84,9.53 v49.83,9.51
  Bottom 0.813: v49.83,9.51 48.23,11.11 22.31,11.11 20.69,12.73 20.69,14.87 19.05,16.51 13.42,16.51 v12.66,15.75
  pour Top (no thermals): 10.83,13.45 10.83,16.53 11.09,16.78 11.09,18.18 12.28,18.18 12.28,13.45
SCL
  Top 0.254: IC4.17 5.04,26.96 4.43,27.57 I2C.3
SCREEN_CTRL  (via drill 0.2, 0.35)
  Top 0.152: IC4.3 20.69,26.32 v20.91,26.53
  Top 0.61: IC2.5 63.13,6.99 v63.13,7
  Bottom 0.254: v20.91,26.53 21.59,25.85 21.59,21.18 29.63,13.13 67.41,13.13 69.86,10.68 69.86,7.72 66.73,4.59 65.04,4.59 63.13,6.5 v63.13,7
SCREEN_PWR  (via drill 0.35)
  Top 0.61: IC2.17 51.1,5.71 47.76,9.06 47.76,17.31 48.39,17.94 71.37,17.94 v71.4,17.97
  Bottom 0.61: v71.4,17.97 77.49,24.06 77.49,26.52 F3.1
SDA
  Top 0.254: IC4.18 4.17,26.32 3.19,27.3 I2C.2
SELF_POWER
  Top 0.152: IC4.14 13.65,28.93
  Top 0.254: 13.65,28.93 14.49,28.93 14.7,28.73 14.7,24.48 16.32,22.86 19.05,22.86 19.2,22.71 D3.A
SWCLK
  Top 0.254: IC4.20 4.79,25.02 4.43,24.66 SWD.3
SWIO
  Top 0.254: SWD.2 3.19,24.82 4.04,25.66 IC4.19
VBB
  Top 0.152: 62.23,1.91 IC2.1 57.15,1.91
  Top 0.61: IC2.11 54.61,13.34 | 54.61,13.34 IC2.10 | IC2.12 53.98,12.06 54.61,12.7 | 54.61,12.7 54.61,13.34 | IC2.20 54.61,1.91 | 54.61,1.91 57.15,1.91 62.23,1.91 | IC2.19 53.98,3.17 54.61,2.54 | 54.61,2.54 54.61,1.91 | IC2.16 53.98,6.99 54.61,6.35 54.61,2.54 | IC2.15 53.98,8.26 54.61,8.89 54.61,12.7 | 73.08,23.44 C3.+
  Top 0.813: C3.+ 72.98,23.44 C4.+ 72.98,8.96 68.8,4.78 68.23,4.78 67.21,3.76 65.65,3.76 64.69,2.8 F1.2
  Top 1.27: 57.15,1.91 57.47,1.59 F1.2
  pour Top (isolate 0.813): 51.65,13.64 51.65,1.59 62.67,1.59 62.67,13.64
VDD  (via drill 0.2, 0.35)
  Top 0.152: 22.86,28.01 C12.1 | 24.32,29.41 24.13,29.21
  Top 0.254: IC4.16 v11.79,27.61 10.8,27.61 C11.1 | IC4.5 v20.82,27.61 | R7.2 13.78,33.06 15.97,30.87 v15.97,27.61 v15.96,27.6 | 27.83,40.64 v27,39.81
  Top 0.508: v20.82,27.61 21.71,27.61 C12.1 | C11.1 9.17,28.26 8.22,29.21 8.22,29.94 7.59,30.57 6.35,30.57 | 6.35,30.57 2.54,30.57 1.94,29.96 I2C.1 SWD.1 | 1WIRE.3 6.95,36.16 6.35,35.56 6.35,30.57
  Top 0.61: IC1.2 26.28,33.11 26.28,30.55 C2.2 25.08,30.16 24.32,29.41 | 24.13,29.21 24.13,28.51 23.63,28.01 22.86,28.01 | BTN.3 34.72,40.64 27.83,40.64 | IC1.TAB 26.8,40.01 v27,39.81
  Bottom 0.152: 20.62,27.66 20.67,27.61 v20.82,27.61
  Bottom 0.254: v15.96,27.6 16.02,27.66 20.62,27.66
  Bottom 0.508: v11.79,27.61 11.8,27.6 v15.96,27.6 15.97,27.61 v20.82,27.61
  other vias: 23.8,38.95 22.53,38.95 22.53,40.22 23.8,40.22 22.53,41.49 25.07,41.49 23.8,41.49 26.34,41.49 27.61,41.49 28.88,41.49 30.15,41.49 30.15,42.76 28.88,42.76 27.61,42.76 26.34,42.76 25.07,42.76 23.8,42.76 22.53,42.76
  pour Top (isolate 0.254, no thermals): 21.87,43.83 25.53,47.49 26.22,47.49 30.72,47.49 31.05,47.16 31.05,31.47 30.84,31.26 23.01,31.26 22.35,31.92 21.87,32.4
  pour Bottom (isolate 0.254, no thermals): 21.87,43.83 25.53,47.49 30.72,47.49 31.05,47.16 31.05,31.47 30.84,31.26 23.01,31.26 21.87,32.4
VIM_BTN
  Top 0.152: IC4.12 13.66,30.24
  Top 0.254: 13.66,30.24 14.73,30.24 14.73,31.41 13.08,31.41 11.28,33.21 11.28,38.1 12.6,39.42 19.05,39.42 19.05,40.64 R9.2
VIM_POWER+
  Top 0.152: OC1.3 3.81,43.18 PWR_BT+.1
VIM_POWER-
  Top 0.152: OC1.4 3.81,40.64 PWR_BT-.1
VIM_PWR_CTRL
  Top 0.254: R9.1 OC1.1
VOUT5V
  Top 0.305: 19.91,11.16 19.58,11.16 L2.2
  Top 0.508: R13.2 5.07,19.68 13.02,19.68 13.75,18.94
  Top 0.61: FAN2.1 34.22,19.62 24.87,19.62 24.21,20.28 15.09,20.28 13.75,18.94
  Top 0.813: C19.2 18.82,5.14 | 13.75,18.94 13.75,16.51 15.38,14.88 17.05,14.88 19.4,12.53 L2.2 | PC_PWR.2 PC_PWR.1
  Top 1.016: C5.2 18.64,7.11 19.4,6.35 | 19.4,8.44 PC_PWR.1
  Top 1.27: 19.4,8.44 L2.2 19.4,6.35 19.4,5.02 19.25,4.96 C19.2